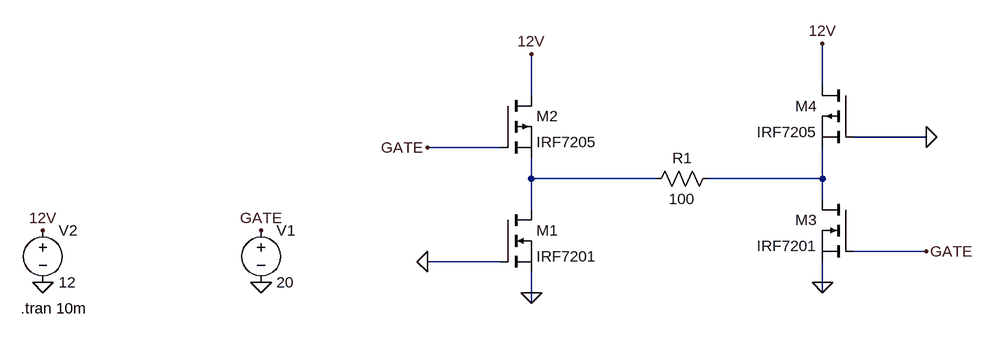
[diagram p0: schematic Draft2.asc]
Draft2.asc, the LTspice schematic file:
Version 4
SHEET 1 1280 680
WIRE 1040 -16 1040 -80
WIRE 592 0 592 -64
WIRE 1200 64 1088 64
WIRE 544 80 432 80
WIRE 592 128 592 96
WIRE 784 128 592 128
WIRE 1040 128 1040 80
WIRE 1040 128 864 128
WIRE 1040 160 1040 128
WIRE 592 176 592 128
WIRE 1200 240 1088 240
WIRE 544 256 432 256
WIRE 1040 288 1040 256
WIRE 592 304 592 272
WIRE 1040 304 1040 288
WIRE 592 320 592 304
FLAG 176 288 0
FLAG -160 288 0
FLAG -160 208 12V
FLAG 176 208 GATE
FLAG 592 304 0
FLAG 592 -64 12V
FLAG 1040 288 0
FLAG 1040 -80 12V
FLAG 432 80 GATE
FLAG 1200 240 GATE
FLAG 432 256 0
FLAG 1200 64 0
SYMBOL voltage 176 192 R0
WINDOW 123 0 0 Left 0
WINDOW 39 0 0 Left 0
SYMATTR InstName V1
SYMATTR Value 20
SYMBOL voltage -160 192 R0
WINDOW 123 0 0 Left 0
WINDOW 39 0 0 Left 0
SYMATTR InstName V2
SYMATTR Value 12
SYMBOL nmos 544 176 R0
SYMATTR InstName M1
SYMATTR Value IRF7201
SYMBOL pmos 544 0 R0
SYMATTR InstName M2
SYMATTR Value IRF7205
SYMBOL nmos 1088 160 M0
SYMATTR InstName M3
SYMATTR Value IRF7201
SYMBOL pmos 1088 -16 M0
SYMATTR InstName M4
SYMATTR Value IRF7205
SYMBOL res 880 112 R90
WINDOW 0 0 56 VBottom 2
WINDOW 3 32 56 VTop 2
SYMATTR InstName R1
SYMATTR Value 100
TEXT -194 328 Left 2 !.tran 10m

The netlist it stands for:
* Draft2.asc
V1 GATE 0 20
V2 12V 0 12
M1 N001 0 0 0 IRF7201
M2 12V GATE N001 N001 IRF7205
M3 N002 GATE 0 0 IRF7201
M4 12V 0 N002 N002 IRF7205
R1 N002 N001 100
.model NMOS NMOS
.model PMOS PMOS
.lib standard.mos
.tran 10m
.backanno
.end